# Altium schematic sheet 16-BitSW.SchDoc
size A4
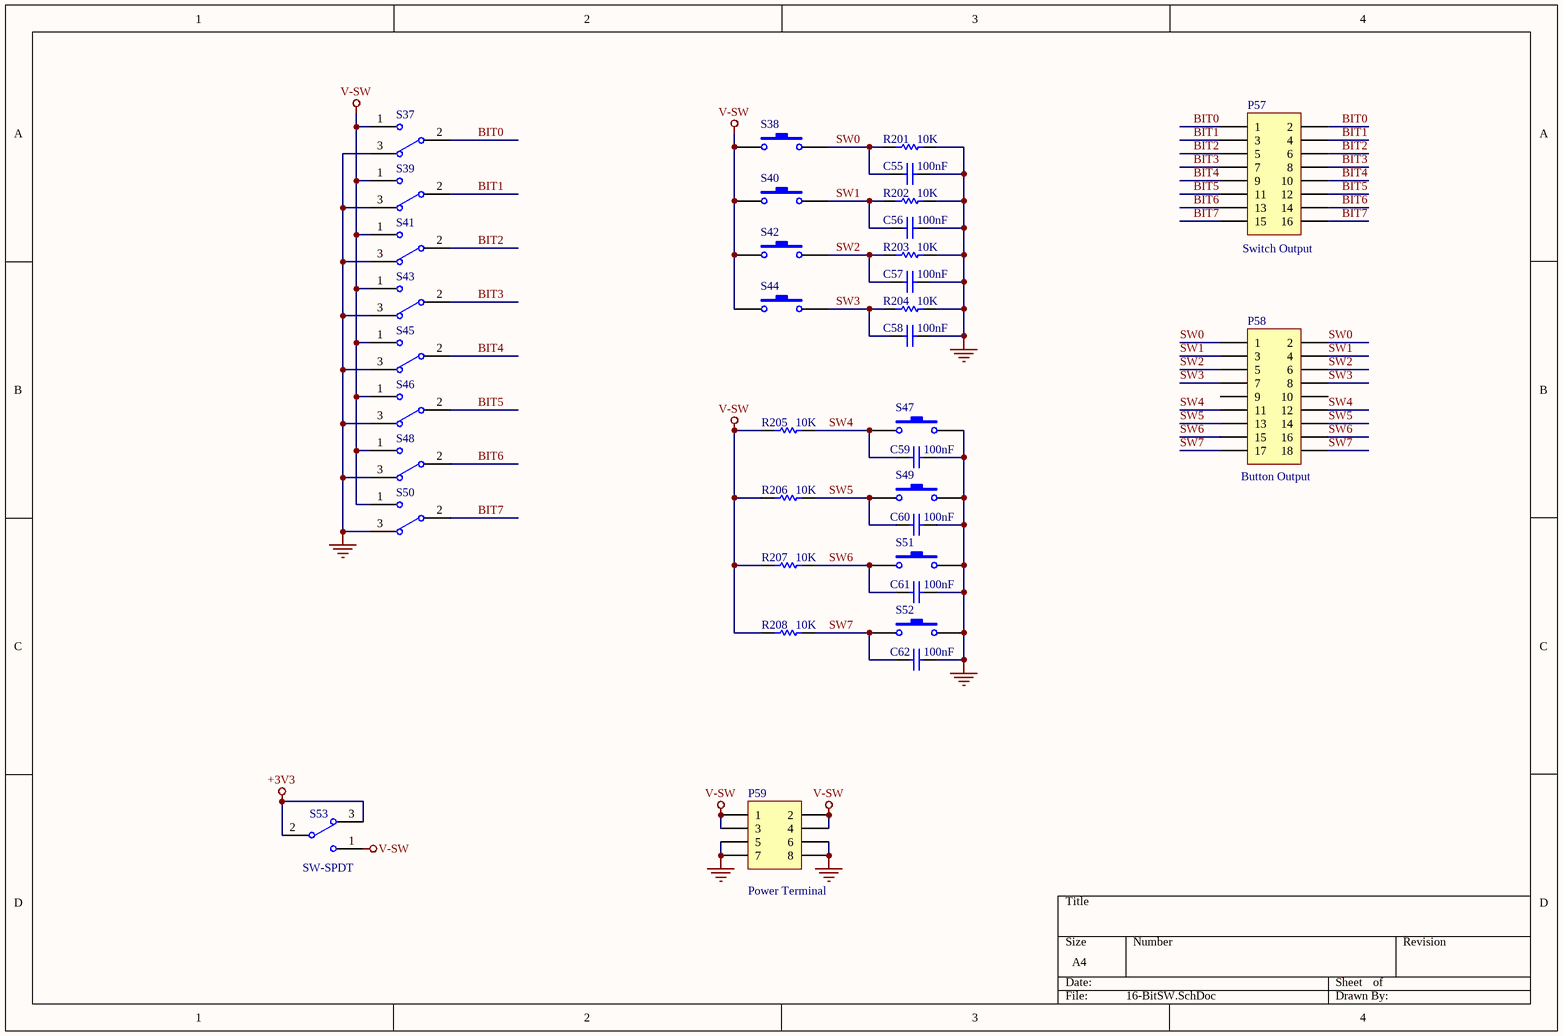
[diagram p0: 16-BitSW.SchDoc]

## Parts
C55  value 100nF  [C-0805]  (hidden comment: 104)
C56  value 100nF  [C-0805]  (hidden comment: 104)
C57  value 100nF  [C-0805]  (hidden comment: 104)
C58  value 100nF  [C-0805]  (hidden comment: 104)
C59  value 100nF  [C-0805]  (hidden comment: 104)
C60  value 100nF  [C-0805]  (hidden comment: 104)
C61  value 100nF  [C-0805]  (hidden comment: 104)
C62  value 100nF  [C-0805]  (hidden comment: 104)
P57  value Switch Output  [HDR2X8]  (hidden comment: Header 8X2)
P58  value Button Output  [HDR2X9]  (hidden comment: Header 9X2)
P59  Publisher: Power Terminal  [HDR2X4]  (hidden comment: Header 4X2)
R201  10K  [r-0805]
R202  10K  [r-0805]
R203  10K  [r-0805]
R204  10K  [r-0805]
R205  10K  [r-0805]
R206  10K  [r-0805]
R207  10K  [r-0805]
R208  10K  [r-0805]
S37  SW-SPDT  [SW-DIP1SMD]  (value not drawn)
S38  SW2  [sw2]  (value not drawn)
S39  SW-SPDT  [SW-DIP1SMD]  (value not drawn)
S40  SW2  [sw2]  (value not drawn)
S41  SW-SPDT  [SW-DIP1SMD]  (value not drawn)
S42  SW2  [sw2]  (value not drawn)
S43  SW-SPDT  [SW-DIP1SMD]  (value not drawn)
S44  SW2  [sw2]  (value not drawn)
S45  SW-SPDT  [SW-DIP1SMD]  (value not drawn)
S46  SW-SPDT  [SW-DIP1SMD]  (value not drawn)
S47  SW2  [sw2]  (value not drawn)
S48  SW-SPDT  [SW-DIP1SMD]  (value not drawn)
S49  SW2  [sw2]  (value not drawn)
S50  SW-SPDT  [SW-DIP1SMD]  (value not drawn)
S51  SW2  [sw2]  (value not drawn)
S52  SW2  [sw2]  (value not drawn)
S53  SW-SPDT  [SW-DIP1SMD]

## Nets
+3V3: S53.2 S53.3
GND: C55.1 C56.1 C57.1 C58.1 C59.1 C60.1 C61.1 C62.1 P59.5 P59.6 P59.7 P59.8 R201.1 R202.1 R203.1 R204.1 S37.3 S39.3 S41.3 S43.3 S45.3 S46.3 S47.2 S48.3 S49.2 S50.3 S51.2 S52.2
V-SW: P59.1 P59.2 P59.3 P59.4 R205.2 R206.2 R207.2 R208.2 S37.1 S38.1 S39.1 S40.1 S41.1 S42.1 S43.1 S44.1 S45.1 S46.1 S48.1 S50.1 S53.1
BIT0: P57.1 P57.2 S37.2
BIT1: P57.3 P57.4 S39.2
BIT2: P57.5 P57.6 S41.2
BIT3: P57.7 P57.8 S43.2
BIT4: P57.9 P57.10 S45.2
BIT5: P57.11 P57.12 S46.2
BIT6: P57.13 P57.14 S48.2
BIT7: P57.15 P57.16 S50.2
SW0: C55.2 P58.1 P58.2 R201.2 S38.2
SW1: C56.2 P58.3 P58.4 R202.2 S40.2
SW2: C57.2 P58.5 P58.6 R203.2 S42.2
SW3: C58.2 P58.7 P58.8 R204.2 S44.2
SW4: C59.2 P58.11 P58.12 R205.1 S47.1
SW5: C60.2 P58.13 P58.14 R206.1 S49.1
SW6: C61.2 P58.15 P58.16 R207.1 S51.1
SW7: C62.2 P58.17 P58.18 R208.1 S52.1

Not connected (* = marked no-connect by the designer): P58 9 10

## Library data of the parts
C55-C62 = Cap: Capacitor; Manufacturer: Generic Components; Class: Passive; Published: 08/06/2000; Publisher: Altium Hobart Technology Centre; SubClass: Capacitor
P57 = Header 8X2: Header, 8-Pin, Dual row; LatestRevisionDate: 17-Jul-2002; LatestRevisionNote: Re-released for DXP Platform.
P58 = Header 9X2: Header, 9-Pin, Dual row; LatestRevisionDate: 17-Jul-2002; LatestRevisionNote: Re-released for DXP Platform.
P59 = Header 4X2: Header, 4-Pin, Dual row; LatestRevisionDate: 17-Jul-2002; LatestRevisionNote: Re-released for DXP Platform.
R201-R208 = Res1: Resistor; Published: 8-Jun-2000; LatestRevisionDate: 17-Jul-2002; LatestRevisionNote: Re-released for DXP Platform.; PackageReference: AXIAL-0.3; Publisher: Altium Limited; PackageDescription: Axial Device, Thru-Hole; 2 Leads; 0.3 in Pin Spacing; Value: 10K
S37 S39 S41 S43 S45 S46 S48 S50 S53 = SW-SPDT: SPDT Subminiature Toggle Switch, Right Angle Mounting, Vertical Actuation; Published: 24-Mar-1999; LatestRevisionDate: 17-Dec-2003; LatestRevisionNote: Schematic revised, PCB Footprint replaced.; DatasheetVersion: 05-Dec-2000; PackageReference: TL36WW15050; Publisher: Altium Limited; PackageDescription: Switch; 4 Leads; ComponentLink1Description: Manufacturer Link; ComponentLink1URL: http://www.apem.com
S38 S40 S42 S44 S47 S49 S51 S52 = SW-PB: Switch; Published: 24-Mar-1999; LatestRevisionDate: 17-Jul-2002; LatestRevisionNote: Re-released for DXP Platform.; PackageReference: SPST-2; Publisher: Altium Limited